# Altium schematic sheet 5V_to_3V3.SchDoc
size A4
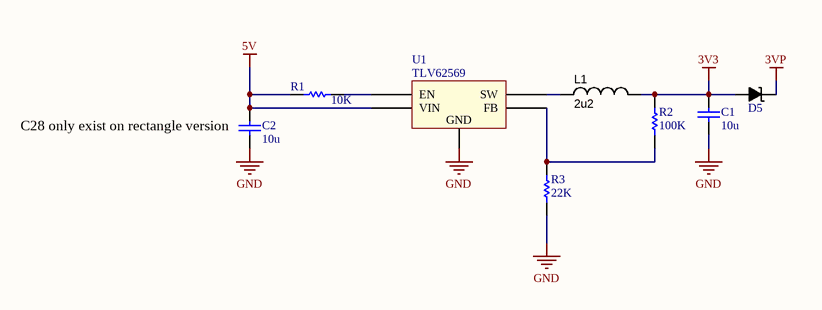
[diagram p0: 5V_to_3V3.SchDoc]

## Parts
C1  value 10u  [CAPC2012X135N]  (hidden comment: Cap)
C2  value 10u  [CAPC2012X135N]  (hidden comment: Cap)
D5  SS24  [DO-214AA]  (value not drawn)
L1  value 2u2  [INDM3225X240N]  (hidden comment: inductor)
R1  value 10K  [RESC1608X55N]  (hidden comment: Res1)
R2  value 100K  [RESC2012X70N]  (hidden comment: Res1)
R3  value 22K  [RESC2012X70N]  (hidden comment: Res1)
U1  TLV62569  [SOT23-5]

## Nets
3V3: C1.2 D5.A(Anode) L1.2 R2.2
3VP: D5.K(Cathode)
5V: C2.2 R1.1 U1.4(VIN)
GND: C1.1 C2.1 R3.2 U1.2(GND)
NetL1_1: L1.1 U1.3(SW)
NetR1_2: R1.2 U1.1(EN)
NetR2_1: R2.1 R3.1 U1.5(FB)

## Notes on the sheet
- (near C2) C28 only exist on rectangle version

## Library data of the parts
C1 C2 = Cap: Capacitor; Published: 8-Jun-2000; LatestRevisionDate: 17-Jul-2002; LatestRevisionNote: Re-released for DXP Platform.; PackageReference: RAD-0.3; Publisher: Altium Limited; PackageDescription: Radial Cap, Thru-Hole; 2 Leads; 0.3 in Pin Spacing
D5 = SS24: 2.0A SURFACE MOUNT SCHOTTKY BARRIER RECTIFIER; Voltage: 40V; Current: 2A
L1 = INDC: IHLP SMD 4040; link: http://www.mouser.hk/ProductDetail/Panasonic/ETQ-P5M4R7YFC/?qs=sGAEpiMZZMsg%252by3WlYCkUx1BJssUTVH58rrEHsPkNus%3d
R1-R3 = Res1: Resistor; Published: 8-Jun-2000; LatestRevisionDate: 17-Jul-2002; LatestRevisionNote: Re-released for DXP Platform.; PackageReference: AXIAL-0.3; Publisher: Altium Limited; PackageDescription: Axial Device, Thru-Hole; 2 Leads; 0.3 in Pin Spacing
U1 = TLV62569: 2-A High Efficiency Synchronous Buck Converter in SOT Package; Manufacturer: TI; Vin: 2.5-5.5V; Iout(max): 2A